# EAGLE design tandy-scott-0.3 (EAGLE 7.1.0)
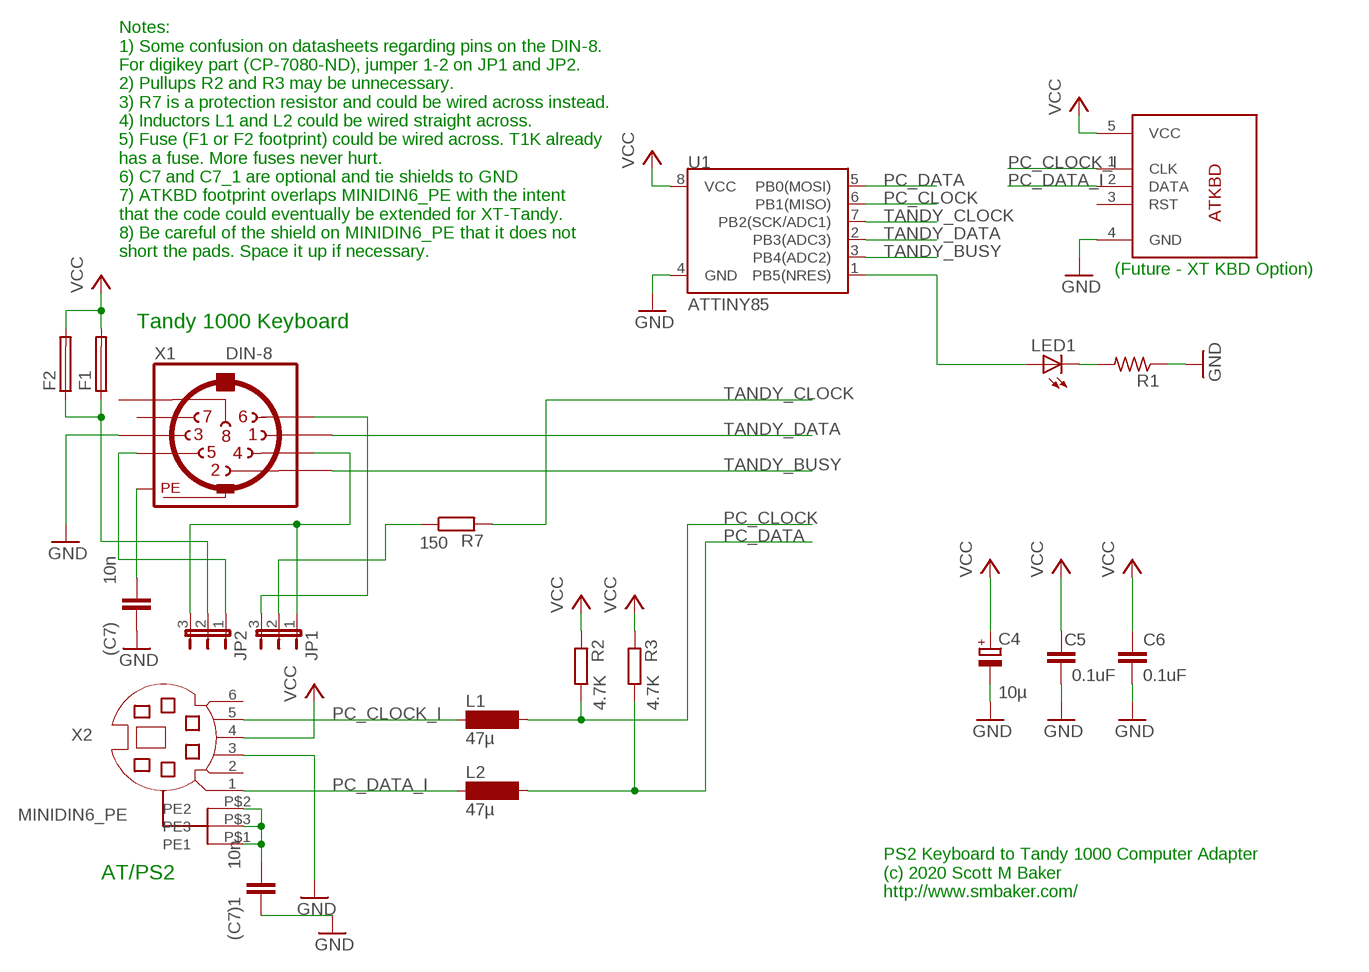
[diagram p0: schematic, sheet 1]

## Parts
(C7)  10n  C-EU025-025X050  [C025-025X050]
(C7)1  10n  C-EU025-025X050  [C025-025X050]
C4  10µ  CPOL-EUE2-5  [E2-5]
C5  0.1uF  C-EU025-025X050  [C025-025X050]
C6  0.1uF  C-EU025-025X050  [C025-025X050]
F1  PTC_FUSE0.200  [PTC_0.200]
F2  PTC_FUSE  [PTC_0.400]
JP1  JP2E  [JP2]
JP2  JP2E  [JP2]
L1  47µ  SD75  [SD75]
L2  47µ  SD75  [SD75]
LED1  LED3MM  [LED3MM]
R1  R-US_0204/7  [0204/7]
R2  4.7K  R-EU_0204/7  [0204/7]
R3  4.7K  R-EU_0204/7  [0204/7]
R7  150  R-EU_0204/7  [0204/7]
U1  ATTINY85  ATTINY45TINY85-20-DIP  [DIP08]
U$2  ATKBDNOHOLES  [DIN_5_FEMALE_SCOTT_DIGIKEY_NOHOLES]
X1  DIN-8  [SDS-80J]
X2  MINIDIN6_PE  [MINIDIN6_PE]

## Nets
GND: (C7)1.2 (C7).2 C4.- C5.1 C6.1 R1.1 U1.4(GND) U$2.4(GND) X1.3 X2.3
N$1: (C7).1 X1.PE X1.PE@(PE)
N$2: JP2.1 X1.5
N$3: JP1.1 JP2.3 X1.4
N$4: LED1.K(C) R1.2
N$5: JP1.3 X1.6
N$7: (C7)1.1 X2.P$1(PE1) X2.P$2(PE2) X2.P$3(PE3)
N$8: LED1.A U1.1(PB5(NRES))
N$9: F1.1 F2.1 JP2.2
N$31: JP1.2 R7.1
PC_CLOCK: L1.2 R2.1 U1.6(PB1(MISO))
PC_CLOCK_I: L1.1 U$2.1(CLK) X2.5
PC_DATA: L2.2 R3.1 U1.5(PB0(MOSI))
PC_DATA_I: L2.1 U$2.2(DATA) X2.1
TANDY_BUSY: U1.3(PB4(ADC2)) X1.2
TANDY_CLOCK: R7.2 U1.7(PB2(SCK/ADC1))
TANDY_DATA: U1.2(PB3(ADC3)) X1.1
VCC: C4.+ C5.2 C6.2 F1.2 F2.2 R2.2 R3.2 U1.8(VCC) U$2.5(VCC) X2.4
Unconnected: U$2.3(RST) X1.7 X1.8 X2.2 X2.6

## Notes on the sheet
- Notes:
  1) Some confusion on datasheets regarding pins on the DIN-8.
  For digikey part (CP-7080-ND), jumper 1-2 on JP1 and JP2.
  2) Pullups R2 and R3 may be unnecessary.
  3) R7 is a protection resistor and could be wired across instead.
  4) Inductors L1 and L2 could be wired straight across.
  5) Fuse (F1 or F2 footprint) could be wired across. T1K already
  has a fuse. More fuses never hurt.
  6) C7 and C7_1 are optional and tie shields to GND
  7) ATKBD footprint overlaps MINIDIN6_PE with the intent
  that the code could eventually be extended for XT-Tandy.
  8) Be careful of the shield on MINIDIN6_PE that it does not
  short the pads. Space it up if necessary.
- (Future - XT KBD Option)
- Tandy 1000 Keyboard
- AT/PS2
- PS2 Keyboard to Tandy 1000 Computer Adapter
  (c) 2020 Scott M Baker
  http://www.smbaker.com/

## Library data of the parts
(C7) (C7)1 C5 C6 = rcl:C-EU: CAPACITOR, European symbol
C4 = rcl:CPOL-EU: POLARIZED CAPACITOR, European symbol
F1 = scott:PTC_FUSE: PICOFUSE 19275, Wickmann
F2 = scott:PTC_FUSE: PICOFUSE 19275, Wickmann; OC_FARNELL: unknown; OC_NEWARK: unknown
JP1 JP2 = jumper:JP2E: JUMPER
L1 L2 = inductor-neosid:SD75: INDUCTOR nominal inductance, E12
LED1 = led:LED: LED OSRAM: - CHIPLED LG R971, LG N971, LY N971, LG Q971, LY Q971, LO R971, LY R971 LH N974, LH R974 LS Q976, LO Q976, LY Q976 LO Q996 - Hyper CHIPLED LW Q18S LB Q993, LB Q99A, LB R99A - SideLED LS A670, LO A670, LY A670, LG A670, LP A670 LB A673, LV A673, LT A673, LW A673 LH A674 LY A675 LS A676, LA A676, LO A676, LY A676, LW A676 LS A679, LY A679, LG A679 - Hyper Micro SIDELED® LS Y876, LA Y876, LO Y876, LY Y876 LT Y87S - SmartLED LW L88C, LW L88S LB L89C, LB L89S, LG L890 LS L89K, LO L89K, LY L89K LS L896, LA L896, LO L896, LY L896 - TOPLED LS T670, LO T670, LY T670, LG T670, LP T670 LSG T670, LSP T670, LSY T670, LOP T670, LYG T670 LG T671, LOG T671, LSG T671 LB T673, LV T673, LT T673, LW T673 LH T674 LS T676, LA T676, LO T676, LY T676, LB T676, LH T676, LSB T676, LW T676 LB T67C, LV T67C, LT T67C, LS T67K, LO T67K, LY T67K, LW E67C LS E67B, LA E67B, LO E67B, LY E67B, LB E67C, LV E67C, LT E67C LW T67C LS T679, LY T679, LG T679 LS T770, LO T770, LY T770, LG T770, LP T770 LB T773, LV T773, LT T773, LW T773 LH T774 LS E675, LA E675, LY E675, LS T675 LS T776, LA T776, LO T776, LY T776, LB T776 LHGB T686 LT T68C, LB T68C - Hyper Mini TOPLED® LB M676 - Mini TOPLED Santana® LG M470 LS M47K, LO M47K, LY M47K Source: http://www.osram.convergy.de LUXEON: - LUMILED® LXK2-PW12-R00, LXK2-PW12-S00, LXK2-PW14-U00, LXK2-PW14-V00 LXK2-PM12-R00, LXK2-PM12-S00, LXK2-PM14-U00 LXK2-PE12-Q00, LXK2-PE12-R00, LXK2-PE12-S00, LXK2-PE14-T00, LXK2-PE14-U00 LXK2-PB12-K00, LXK2-PB12-L00, LXK2-PB12-M00, LXK2-PB14-N00, LXK2-PB14-P00, LXK2-PB14-Q00 LXK2-PR12-L00, LXK2-PR12-M00, LXK2-PR14-Q00, LXK2-PR14-R00 LXK2-PD12-Q00, LXK2-PD12-R00, LXK2-PD12-S00 LXK2-PH12-R00, LXK2-PH12-S00 LXK2-PL12-P00, LXK2-PL12-Q00, LXK2-PL12-R00 Source: www.luxeon.com KINGBRIGHT: KA-3528ASYC Source: www.kingbright.com
R1 = resistor:R-US_: RESISTOR, American symbol
R2 R3 R7 = rcl:R-EU_: RESISTOR, European symbol
U1 = SparkFun-DigitalIC:ATTINY45: Atmel 8-pin 2/4/8kB flash uC; PROD_ID: IC-09445; VALUE: TINY85-20-DIP
U$2 = scott:ATKBD
X1 = scott:DIN-8: Female CONNECTOR 8 pins with shield, horizontal (DIN 41524); MF: FARNELL; MPN: MAB 8 SH; OC_FARNELL: 809913; OC_NEWARK: 67C7888
X2 = bla:MINIDIN6_PE

## Net classes
1 pwr: width 0.508 mm
2 HV: width 0.61 mm, clearance 0.762 mm to class 0

## Board
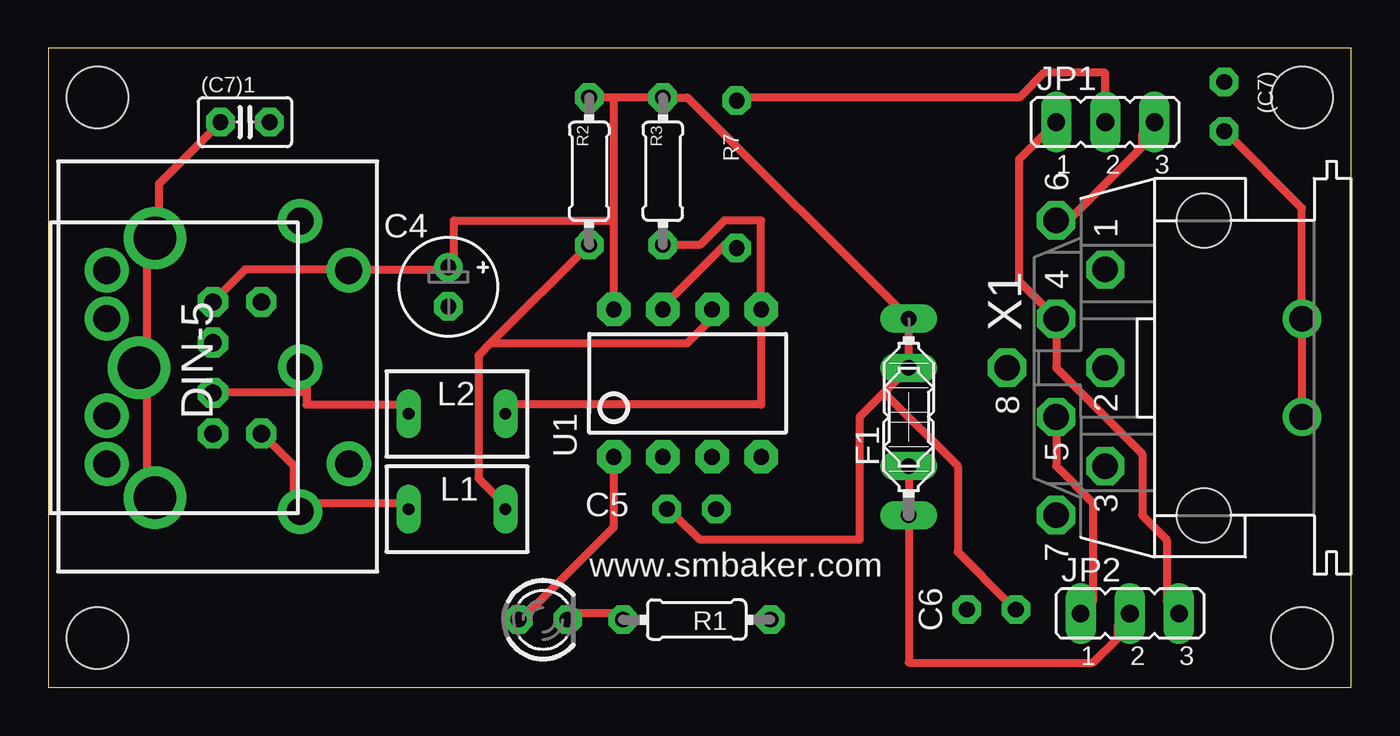
[diagram p1: board, top side]
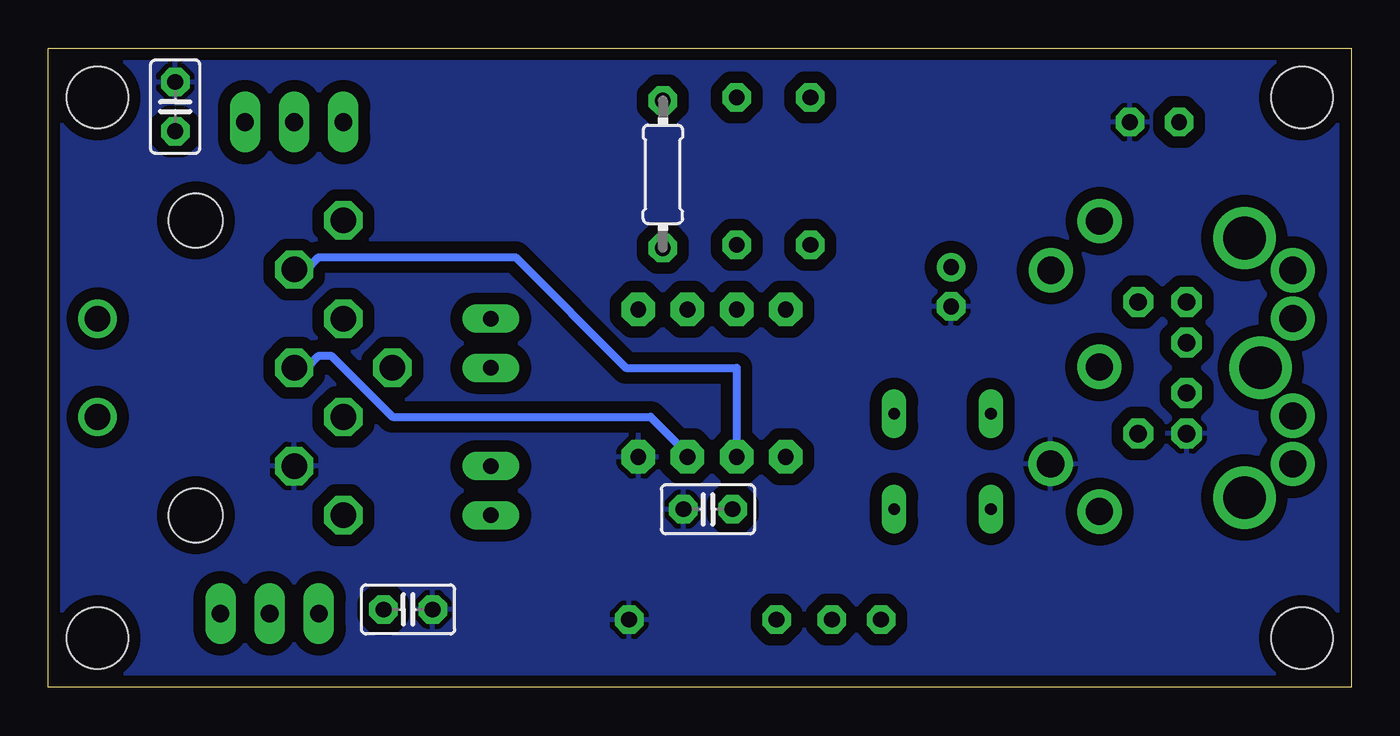
[diagram p2: board, bottom side, seen from below]

Size 67.31 x 33.02 mm. Coordinates in mm from the lower left corner, seen from the top.
Outline: 67.31,0 67.31,33.02 0,33.02 0,0 67.31,0
Copper layers (1*16): Top 0.035mm / dielectric 1.5mm / Bottom 0.035mm
Design rules "default *": minimum track width 16mil, minimum drill 24mil, track to track 12mil, track to pad 12mil, pad to pad 16mil, via to via 16mil, smd to smd 16mil, copper to edge 20mil, drill to drill 8mil, minimum pad ring 13mil, minimum via ring 8mil, stop-mask expansion 4mil, vias tented up to drill 0mil, thermal gap 10mil
Holes 3.17 mm at 2.54,30.48 2.54,2.54 64.77,2.54 64.77,30.48

### Footprints (pad centres in the part's own frame; a part is rotated, then mirrored left to right if it is on the bottom)
C025-025X050 = drill 0.813 octagon: 1 -1.27,0; 2 1.27,0
E2-5 = drill 0.813 pad 1.27: + -1.016,0 | drill 0.813 pad 1.27 octagon: - 1.016,0
PTC_0.200 = drill 0.813 long: 1 -2.54,0; 2 2.54,0
PTC_0.400 = drill 0.813 long: 1 -5.08,0; 2 5.08,0
JP2 = drill 0.914 long: 1 -2.54,0; 2 0,0; 3 2.54,0
SD75 = drill 0.6 long: 1 -2.5,0; 2 2.5,0
LED3MM = drill 0.813 octagon: A -1.27,0; K 1.27,0
0204/7 = drill 0.813 octagon: 1 -3.81,0; 2 3.81,0
DIP08 = drill 0.813 pad 1.727 octagon: 1 -3.81,-3.81; 2 -1.27,-3.81; 3 1.27,-3.81; 4 3.81,-3.81; 5 3.81,3.81; 6 1.27,3.81; 7 -1.27,3.81; 8 -3.81,3.81
DIN_5_FEMALE_SCOTT_DIGIKEY_NOHOLES = drill 1.4 pad 2.286: 1 7.94,4.87; 2 0.46,4.88; 3 -7.07,4.87; 4 5.47,7.4; 5 -4.53,7.39; 6 -4.53,-5.112; 7 5.478,-5.112; 8 -2.041,-5.112; 9 2.988,-5.112
SDS-80J = drill 1.321 octagon: 1 5.08,5.08; 2 0,5.08; 3 -5.08,5.08; 4 2.54,7.62; 5 -2.54,7.62; 6 7.62,7.62; 7 -7.62,7.62; 8 0,10.16 | drill 1.321: PE -2.54,-5.08; PE@ 2.54,-5.08 | hole 2.794: -7.62,0; 7.62,0
MINIDIN6_PE = drill 0.9 octagon: 1 1.3,2.15; 2 -1.3,2.15; 3 3.4,2.15; 4 -3.4,2.15; 5 3.4,4.65; 6 -3.4,4.65 | drill 2.2: P$1 0,-1.676; P$2 -6.706,-0.838; P$3 6.706,-0.838

### Placement (x,y rotation side)
(C7)  60.76,30.01 90 bottom
(C7)1  10.16,29.21 0 top
C4  20.67,20.69 270 top
C5  33.23,9.2 0 bottom
C6  48.72,4.02 180 bottom
F1  44.45,13.97 90 top
F2  44.45,13.97 90 top
JP1  54.61,29.21 0 top
JP2  55.88,3.81 0 top
L1  21.11,9.21 0 top
L2  21.11,14.13 0 top
LED1  25.56,3.49 0 top
R1  33.5,3.49 180 top
R2  27.94,26.67 90 top
R3  31.75,26.67 90 top
R7  35.56,26.51 270 bottom
U1  33.02,15.72 0 top
U$2  8.13,17.02 270 top
X1  59.69,16.51 90 top
X2  6.35,16.51 270 top

### Tracks (layer width: path | path; a pad name or v marks a point on that pad's centre or on a via)
GND
  pour Bottom (isolate 0.61): 67.14,-0.13 67.11,32.86 -0.17,32.86 -0.14,-0.1
N$1
  Top 0.406: (C7).1 60.96,28.57 64.77,24.77 X1.PE@ X1.PE
N$2
  Top 0.406: JP2.1 53.98,4.45 53.98,9.53 52.07,11.43 X1.5
N$3
  Top 0.406: JP1.1 50.16,27.3 50.16,20.95 X1.4 52.07,16.51 56.52,12.06 56.52,8.89 57.78,7.62 57.78,4.45 JP2.3
N$4
  Top 0.406: LED1.K 27.3,3.81 29.21,3.81 R1.2
N$5
  Top 0.406: JP1.3 56.52,28.57 56.52,27.94 52.7,24.13 X1.6
N$7
  Top 0.406: (C7)1.1 5.71,26.04 5.71,23.5 X2.P$2 5.08,22.86 5.08,16.51 | 5.08,16.51 5.08,10.16 X2.P$3 | 5.08,16.51 X2.P$1
N$8
  Top 0.406: U1.1 29.21,8.26 24.77,3.81 LED1.A
N$9
  Top 0.406: F1.1 F2.1 44.45,1.27 53.98,1.27 55.24,2.54 55.24,3.17 JP2.2
N$31
  Top 0.406: JP1.2 54.61,31.75 51.44,31.75 50.16,30.48 35.56,30.48 R7.1
PC_CLOCK
  Top 0.406: R2.1 22.86,17.78 | 22.86,17.78 22.23,17.14 22.23,10.79 23.5,9.53 L1.2 | 22.86,17.78 33.02,17.78 34.29,19.05 U1.6
PC_CLOCK_I
  Top 0.406: L1.1 18.41,9.53 13.34,9.53 U$2.1 12.7,9.53 12.7,11.43 11.43,12.7 X2.5
PC_DATA
  Top 0.406: L2.2 24.13,14.61 36.83,14.61 U1.5 36.83,24.13 34.92,24.13 33.66,22.86 R3.1
PC_DATA_I
  Top 0.406: 13.34,15.24 13.34,16.51 U$2.2 | 13.34,15.24 13.34,14.61 18.41,14.61 L2.1 | 13.34,15.24 8.89,15.24 X2.1
TANDY_BUSY
  Bottom 0.406: X1.2 53.98,16.51 53.34,17.14 52.7,17.14 49.53,13.97 36.2,13.97 34.29,12.06 U1.3
TANDY_CLOCK
  Top 0.406: R7.2 34.92,22.86 31.75,19.68 U1.7
TANDY_DATA
  Bottom 0.406: U1.2 31.75,16.51 37.47,16.51 43.18,22.23 53.34,22.23 53.98,21.59 X1.1
VCC
  Top 0.406: 43.18,15.24 F1.2 F2.2 33.02,30.48 R3.2 29.21,30.48 | 43.18,15.24 41.91,13.97 41.91,7.62 33.66,7.62 32.38,8.89 C5.2 | 43.18,15.24 46.99,11.43 46.99,6.99 49.53,4.45 C6.2 | 29.21,30.48 R2.2 | 29.21,30.48 29.21,24.13 | 29.21,24.13 U1.8 | X2.4 8.89,20.32 10.16,21.59 15.24,21.59 U$2.5 15.88,21.59 20.32,21.59 C4.+ 20.95,22.23 20.95,24.13 29.21,24.13

### Text on the board
tPlace: www.smbaker.com